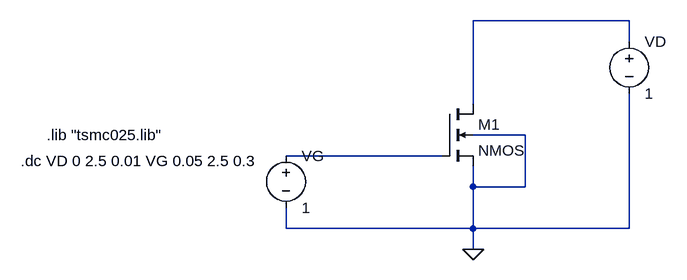
[diagram p0: schematic 250n_IDVD.asc]
250n_IDVD.asc, the LTspice schematic file:
Version 4
SHEET 1 1412 680
WIRE 480 -32 240 -32
WIRE 480 0 480 -32
WIRE 240 96 240 -32
WIRE 320 144 240 144
WIRE 192 176 -48 176
WIRE 240 224 240 192
WIRE 320 224 320 144
WIRE 320 224 240 224
WIRE -48 288 -48 256
WIRE 240 288 240 224
WIRE 240 288 -48 288
WIRE 480 288 480 80
WIRE 480 288 240 288
WIRE 240 320 240 288
FLAG 240 320 0
SYMBOL nmos4 192 96 R0
SYMATTR InstName M1
SYMATTR Value2 l=240n w=360n
SYMBOL voltage -48 160 R0
SYMATTR InstName VG
SYMATTR Value 1
SYMBOL voltage 480 -16 R0
WINDOW 123 0 0 Left 0
WINDOW 39 0 0 Left 0
SYMATTR InstName VD
SYMATTR Value 1
TEXT -416 144 Left 2 !.lib "tsmc025.lib"
TEXT -456 184 Left 2 !.dc VD 0 2.5 0.01 VG 0.05 2.5 0.3

The netlist it stands for:
* 250n_IDVD.asc
M1 N001 N002 0 0 NMOS l=240n w=360n
VG N002 0 1
VD N001 0 1
.model NMOS NMOS
.model PMOS PMOS
.lib standard.mos
.lib "tsmc025.lib"
.dc VD 0 2.5 0.01 VG 0.05 2.5 0.3
.backanno
.end